# EAGLE design ZigFlea_v7 (EAGLE 5.08)
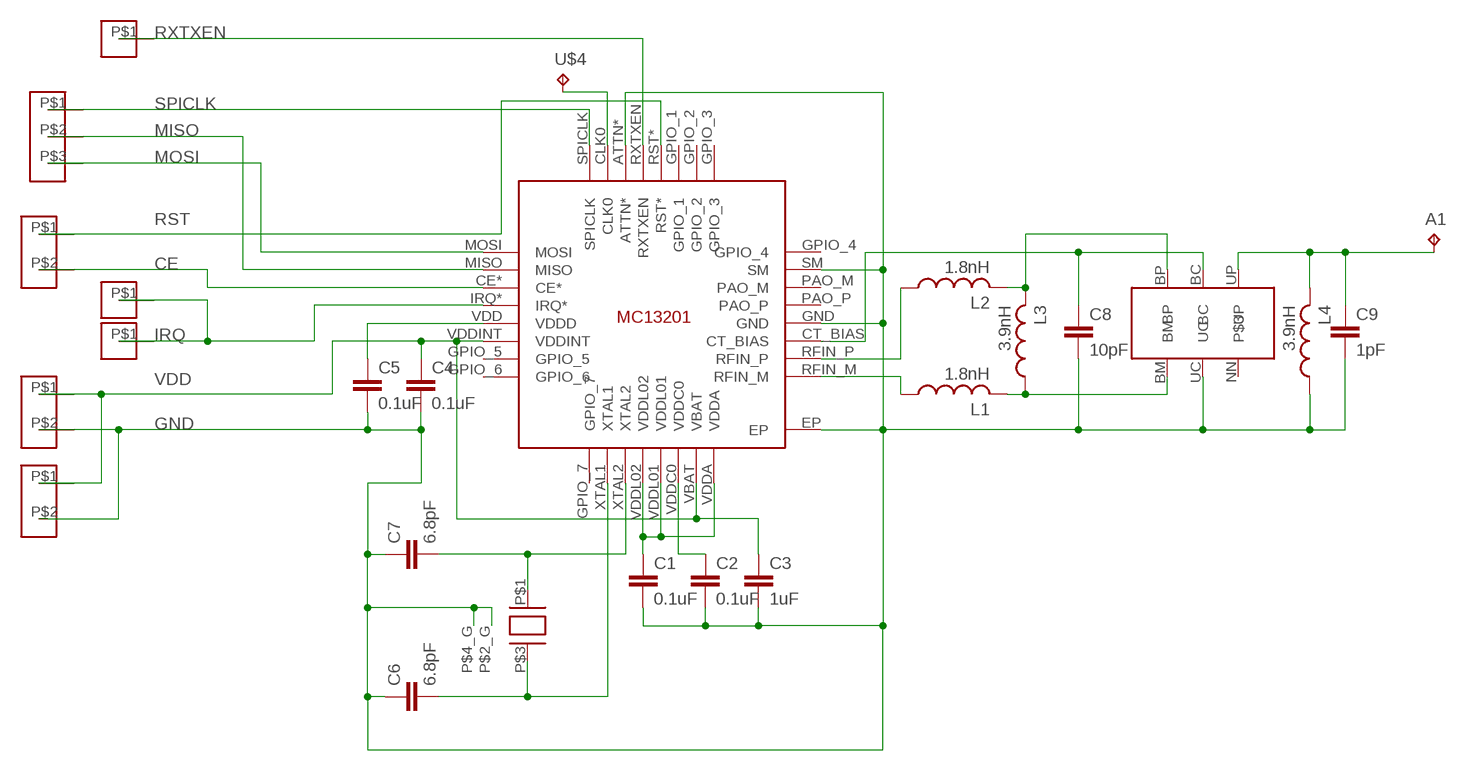
[diagram p0: schematic, sheet 1]

## Parts
A1  TPTP06SQ  [TP06SQ]
C1  0.1uF  C-EUC0603  [C0603]
C2  0.1uF  C-EUC0603  [C0603]
C3  1uF  C-EUC0603  [C0603]
C4  0.1uF  C-EUC0603  [C0603]
C5  0.1uF  C-EUC0603  [C0603]
C6  6.8pF  C-EUC0603  [C0603]
C7  6.8pF  C-EUC0603  [C0603]
C8  10pF  C-EUC0603  [C0603]
C9  1pF  C-EUC0603  [C0603]
L1  1.8nH  SPOLE0603  [SPOLE0603]
L2  1.8nH  SPOLE0603  [SPOLE0603]
L3  3.9nH  SPOLE0603  [SPOLE0603]
L4  3.9nH  SPOLE0603  [SPOLE0603]
RD1  PINHEAD1_1MM  [PINHEAD_1MM]
RD8  PINHEAD1_1MM  [PINHEAD_1MM]
RE4  PINHEAD1_1MM  [PINHEAD_1MM]
U$1  MC13201  [MC13201]
U$2  16MHZ  [16MHZ]
U$3  BALUN  [BALUN]
U$4  TPTP06SQ  [TP06SQ]
U$5  PINHEAD3_1MM  [PINHEAD3_1MM]
U$6  PINHEAD2_1MM  [PINHEAD2_1MM]
U$7  PINHEAD2_1MM  [PINHEAD2_1MM]
U$8  PINHEAD2_1MM  [PINHEAD2_1MM]

## Nets
A1: A1.TP C9.1 L4.P$2 U$3.UP
CE: U$1.CE* U$6.P$2
GND: C1.2 C2.2 C3.2 C4.2 C5.2 C6.1 C7.1 C8.2 C9.2 L4.P$1 U$1.ATTN* U$1.EP U$1.GND U$1.SM U$2.P$2_G(P$3_G) U$2.P$4_G U$3.UC U$7.P$2 U$8.P$2
IRQ: RD1.P$1 RD8.P$1 U$1.IRQ*
MISO: U$1.MISO U$5.P$2
MOSI: U$1.MOSI U$5.P$3
N$1: C1.1 U$1.VDDA U$1.VDDL01 U$1.VDDL02
N$2: C2.1 U$1.VDDC0
N$3: U$1.CLK0 U$4.TP
N$4: C7.2 U$1.XTAL2 U$2.P$1
N$6: L1.P$1 U$1.RFIN_M
N$7: L2.P$1 U$1.RFIN_P
N$8: C5.1 U$1.VDD(VDDD)
N$9: C6.2 U$1.XTAL1 U$2.P$3
N$10: C8.1 U$1.CT_BIAS U$3.BC
N$11: L1.P$2 L3.P$1 U$3.BM
N$12: L2.P$2 L3.P$2 U$3.BP
RST: U$1.RST* U$6.P$1
RXTXEN: RE4.P$1 U$1.RXTXEN
SPICLK: U$1.SPICLK U$5.P$1
VDD: C3.1 C4.1 U$1.VBAT U$1.VDDINT U$7.P$1 U$8.P$1
Unconnected: U$1.GPIO_1 U$1.GPIO_2 U$1.GPIO_3 U$1.GPIO_4 U$1.GPIO_5 U$1.GPIO_6 U$1.GPIO_7 U$1.PAO_M U$1.PAO_P U$3.NN

## Library data of the parts
A1 U$4 = testpad:TP: Test pad
C1-C9 = resistor:C-EU: CAPACITOR, European symbol
L1-L4 = resistor:SPOLE0603
RD1 RD8 RE4 = Pinhead_my:PINHEAD1_1MM
U$1 = mc13201:MC13201
U$2 = mc13201:16MHZ
U$3 = freescale_16qfn:BALUN
U$5 = Pinhead_my:PINHEAD3_1MM
U$6-U$8 = Pinhead_my:PINHEAD2_1MM

## Board
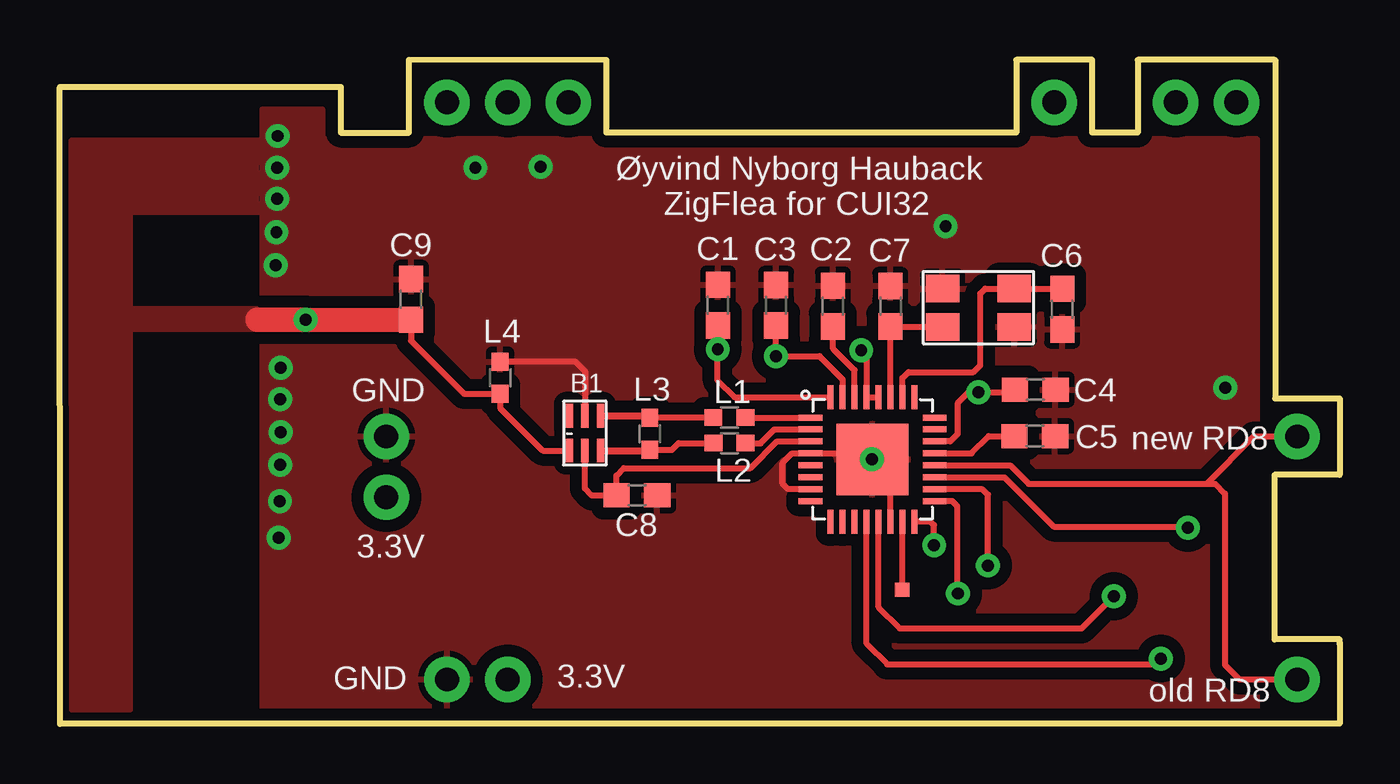
[diagram p1: board, top side]
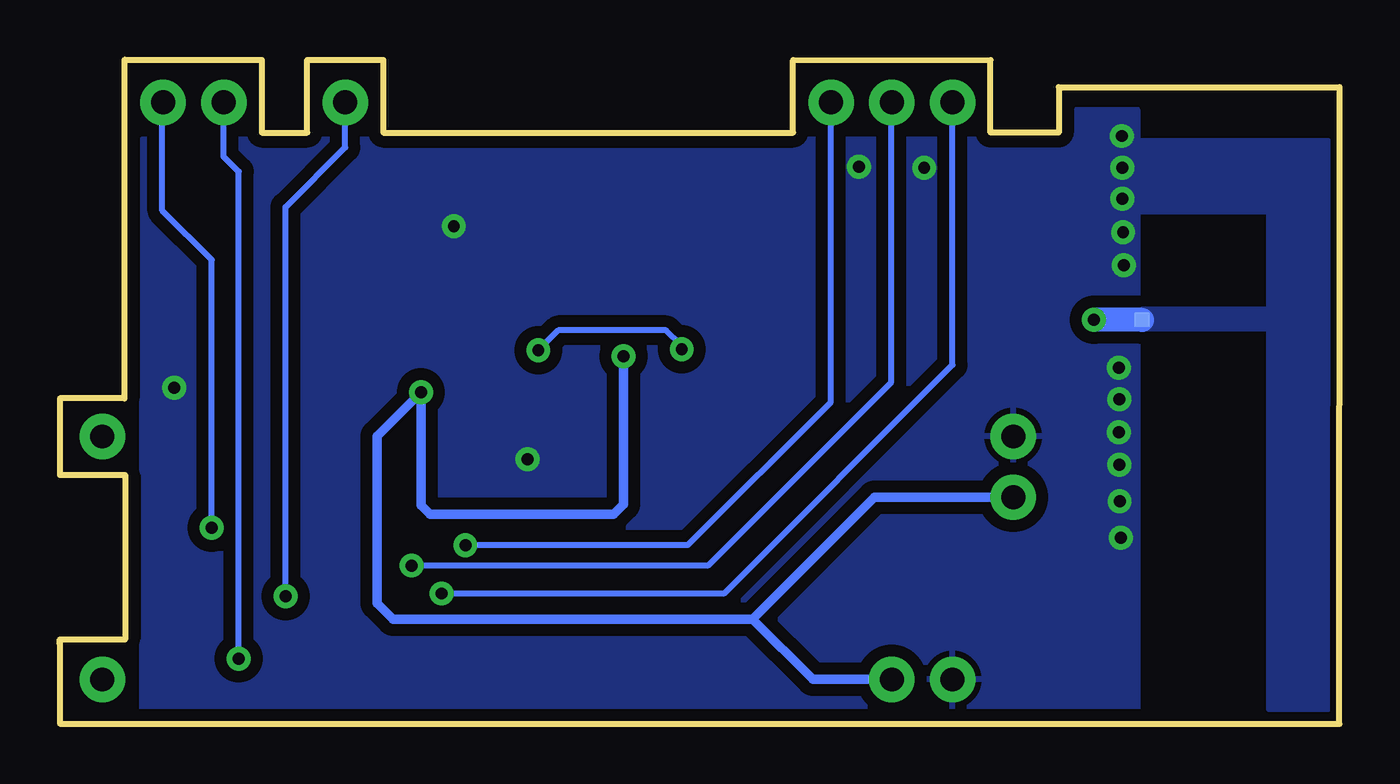
[diagram p2: board, bottom side, seen from below]

Size 53.53 x 27.76 mm. Coordinates in mm from the lower left corner, seen from the top.
Outline: 53.53,3.33 53.53,3.53 50.8,3.53 50.8,10.41 53.53,10.41 53.53,13.61 50.83,13.61 50.83,27.76 50.8,27.76
Outline: 50.8,27.76 45.09,27.76 45.09,24.71 43.18,24.71 43.18,27.76 40,27.76 40,24.71 22.86,24.71 22.86,27.75 14.6,27.76 14.6,24.71 11.75,24.71 11.75,26.62 0,26.62 0.01,0 53.53,0.01 53.53,3.44
Copper layers (1*16): Top 0.035mm / dielectric 1.5mm / Bottom 0.035mm
Design rules "SeedDRC": minimum track width 6mil, minimum drill 10mil, track to track 6mil, track to pad 6mil, pad to pad 6mil, via to via 6mil, smd to smd 6mil, copper to edge 10mil, drill to drill 10mil, minimum pad ring 10mil, minimum via ring 6mil, stop-mask expansion 2mil, vias tented up to drill 100mil, thermal gap 10mil

### Footprints (pad centres in the part's own frame; a part is rotated, then mirrored left to right if it is on the bottom)
TP06SQ = smd 0.6 x 0.6: TP 0,0
C0603 = smd 1.1 x 1: 1 -0.85,0; 2 0.85,0
SPOLE0603 = smd 0.75 x 0.7: P$1 -0.675,0; P$2 0.675,0
PINHEAD_1MM = drill 1 pad 1.9 round: P$1 0,0
MC13201 = smd 0.25 x 1: ATTN* -0.75,2.6; CLK0 -1.25,2.6; GPIO_1 0.75,2.6; GPIO_2 1.25,2.6; GPIO_3 1.75,2.6; GPIO_7 -1.75,-2.6; RST* 0.25,2.6; RXTXEN -0.25,2.6; SPICLK -1.75,2.6; VBAT 1.25,-2.6; VDDA 1.75,-2.6; VDDC0 0.75,-2.6; VDDL01 0.25,-2.6; VDDL02 -0.25,-2.6; XTAL1 -1.25,-2.6; XTAL2 -0.75,-2.6 | smd 1 x 0.25: CE* -2.6,0.75; CT_BIAS 2.6,-0.75; GND 2.6,-0.25; GPIO_4 2.6,1.75; GPIO_5 -2.6,-1.25; GPIO_6 -2.6,-1.75; IRQ* -2.6,0.25; MISO -2.6,1.25; MOSI -2.6,1.75; PAO_M 2.6,0.75; PAO_P 2.6,0.25; RFIN_M 2.6,-1.75; RFIN_P 2.6,-1.25; SM 2.6,1.25; VDD -2.6,-0.25; VDDINT -2.6,-0.75 | smd 3 x 3: EP 0,0
16MHZ = smd 1.4 x 1.15: P$1 1.5,0.8; P$2_G 1.5,-0.8; P$3 -1.5,-0.8; P$4_G -1.5,0.8
BALUN = smd 0.3 x 1: BC 0.65,1.45; BM 0,0; BP 0,1.45; NN 1.3,0; UC 0.65,0; UP 1.3,1.45
PINHEAD3_1MM = drill 1 pad 1.9 round: P$1 0,2.54; P$2 0,0; P$3 0,-2.54
PINHEAD2_1MM = drill 1 pad 1.9 round: P$1 0,1.27; P$2 0,-1.27

### Placement (x,y rotation side)
A1  8.27,16.89 0 bottom
C1  27.53,17.51 90 top
C2  32.33,17.47 90 top
C3  29.96,17.5 90 top
C4  40.8,13.98 0 top
C5  40.77,12.03 0 top
C6  41.92,17.34 90 top
C7  34.74,17.46 270 top
C8  24.14,9.55 0 top
C9  14.69,17.75 90 top
L1  28,12.81 180 top
L2  28.01,11.74 180 top
L3  24.67,12.13 270 top
L4  18.42,14.47 270 top
RD1  51.75,12.01 0 top
RD8  51.75,1.85 0 top
RE4  41.59,25.98 0 top
U$1  33.99,11.06 180 top
U$2  38.42,17.4 180 top
U$3  22.61,12.88 180 top
U$4  35.23,5.61 180 top
U$5  18.73,25.98 270 top
U$6  47.94,25.98 90 top
U$7  13.65,10.74 180 top
U$8  17.46,1.85 270 top

### Tracks (layer width: path | path; a pad name or v marks a point on that pad's centre or on a via)
A1  (via drill 0.5 pad 1)
  Top 0.25: U$3.UP 20.2,11.43 18.42,13.2 18.42,13.79 L4.P$2 16.91,13.79 14.69,16.02 C9.1
  Top 1: A1.TP C9.1 | A1.TP | v10.28,16.9 A1.TP
  Bottom 1: A1.TP v10.27,16.89 v10.28,16.9
  pour Top (isolate 0.254, no thermals): 8.52,21.39 8.52,24.39 0.47,24.39 0.47,0.59 2.97,0.59 2.97,16.49 8.27,16.49 8.27,17.34 2.97,17.34 2.97,21.39
  pour Bottom (no thermals): 8.27,17.34 2.97,17.34 2.97,21.39 8.52,21.39 8.52,24.39 0.47,24.39 0.47,0.59 2.97,0.59 2.97,16.49 8.27,16.49
CE  (via drill 0.5 pad 1)
  Top 0.25: U$1.CE* 39.51,10.31 41.57,8.25 47.13,8.25 v47.17,8.2
  Bottom 0.25: v47.17,8.2 47.17,19.39 49.24,21.46 49.24,25.96 U$6.P$2
GND  (via drill 0.5 pad 1)
  Top 0.25: U$1.ATTN* 34.74,10.31 U$1.EP 33.74,11.31 | C1.2 | U$3.UC 21.96,14.74 21.55,15.16 18.43,15.16 L4.P$1 | 33,11.31 32.99,11.31 U$1.GND 30.63,11.31 30.23,10.91 30.23,10.04 30.46,9.81 U$1.SM
  other vias: 9.06,20.56 37.05,20.8 9.03,19.17 9.21,9.31 9.21,10.84 9.15,7.78 33.97,11.06 9.24,12.19 9.21,13.57 9.24,14.89 9.09,21.96 9.09,23.25 9.11,24.58 17.38,23.25 20.11,23.29 48.75,14.04
  pour Bottom (isolate 0.5): 8.47,25.68 8.47,0 50.08,0 50.08,24.43 10.99,24.43 10.99,25.68
  pour Top (isolate 0.5): 8.47,25.68 8.47,0 50.08,0 50.08,24.43 10.99,24.43 10.99,25.68
IRQ
  Top 0.25: U$1.IRQ* 39.75,10.81 40.53,10.03 47.96,10.03 | RD8.P$1 49.34,1.85 48.73,2.46 48.73,9.63 48.32,10.03 47.96,10.03 | RD1.P$1 49.94,12.01 47.96,10.03
MISO  (via drill 0.5 pad 1)
  Top 0.25: U$1.MISO 38.59,9.81 38.82,9.58 v38.82,6.62
  Bottom 0.25: v38.82,6.62 26.43,6.62 18.76,14.29 18.76,25.96 U$5.P$2
MOSI  (via drill 0.5 pad 1)
  Top 0.25: U$1.MOSI 37.33,9.31 37.54,9.1 37.54,5.47 v37.56,5.45
  Bottom 0.25: v37.56,5.45 25.76,5.45 16.2,15.01 U$5.P$3
N$1  (via drill 0.5 pad 1)
  Top 0.25: U$1.VDDL02 U$1.VDDL01 33.74,15.4 v33.52,15.62 | U$1.VDDA 28.21,13.66 27.52,14.35 v27.52,15.66 27.52,16.65 C1.1
  Bottom 0.25: v27.52,15.66 27.56,15.7 27.56,15.84 28.17,16.45 32.69,16.45 v33.52,15.62
N$2
  Top 0.25: 32.32,16.61 C2.1 32.34,15.69 33.24,14.79 U$1.VDDC0
N$3
  Top 0.25: U$1.CLK0 35.24,5.62 U$4.TP
N$4
  Top 0.25: U$1.XTAL2 C7.2 U$2.P$1
N$6
  Top 0.25: U$1.RFIN_M L1.P$1
N$7
  Top 0.25: U$1.RFIN_P 29.89,12.31 29.31,11.73 L2.P$1
N$8
  Top 0.25: U$1.VDD 38.14,11.31 38.86,12.03 C5.1 | C5.1
N$9
  Top 0.25: C6.2 39.93,18.19 U$2.P$3 38.71,18.2 38.49,17.98 38.49,14.99 38.21,14.71 35.5,14.71 35.24,14.45 U$1.XTAL1
N$10
  Top 0.25: U$1.CT_BIAS 29.99,11.81 28.88,10.69 23.59,10.69 23.28,10.38 C8.1 22.25,9.55 21.95,9.85 21.96,9.86 U$3.BC
N$11
  Top 0.25: L3.P$1 L1.P$2 | L3.P$1 | L3.P$1 24.64,12.81 24.57,12.88
  Top 0.3: U$3.BM 24.57,12.88
N$12
  Top 0.25: L3.P$2 24.75,11.37 | L2.P$2 25.89,11.74 25.6,11.45 L3.P$2 | L3.P$2 24.55,11.45 24.52,11.43
  Top 0.3: U$3.BP 24.52,11.43
RST  (via drill 0.5 pad 1)
  Top 0.25: U$1.RST* 33.74,3.36 34.61,2.49 45.81,2.49 v46.05,2.73
  Bottom 0.25: U$6.P$1 46.68,23.72 46.05,23.09 v46.05,2.73
RXTXEN  (via drill 0.5 pad 1)
  Top 0.25: U$1.RXTXEN 34.24,4.88 35.13,3.99 42.74,3.99 v44.09,5.34
  Bottom 0.25: v44.09,5.34 44.09,21.6 41.59,24.1 RE4.P$1
SPICLK  (via drill 0.5 pad 1)
  Top 0.25: U$1.SPICLK 36.42,8.46 36.57,8.31 v36.57,7.47
  Bottom 0.25: v36.57,7.47 27.27,7.47 21.29,13.45 21.29,25.97 U$5.P$1
VDD  (via drill 0.5 pad 1)
  Top 0.25: U$1.VDDINT 37.24,11.81 37.55,12.11 37.55,13.4 38.01,13.86 v38.43,13.86 39.83,13.86 C4.1 | v29.96,15.37 C3.1 | v29.96,15.37 | U$1.VBAT 32.74,14.41 31.78,15.37 v29.96,15.37
  Bottom 0.4: U$7.P$1 19.46,9.47 24.56,4.38 | 24.56,4.38 39.6,4.38 40.26,5.04 40.26,12.03 v38.43,13.86 38.43,9.15 38.05,8.77 30.37,8.77 29.96,9.18 v29.96,15.37 | U$8.P$1 22.03,1.85 24.56,4.38

### Text on the board
tPlace: Øyvind Nyborg Hauback | ZigFlea for CUI32 | GND | new RD8 | 3.3V | GND | 3.3V | old RD8
tNames: B1